# Altium schematic sheet seashell.SchDoc
size Letter
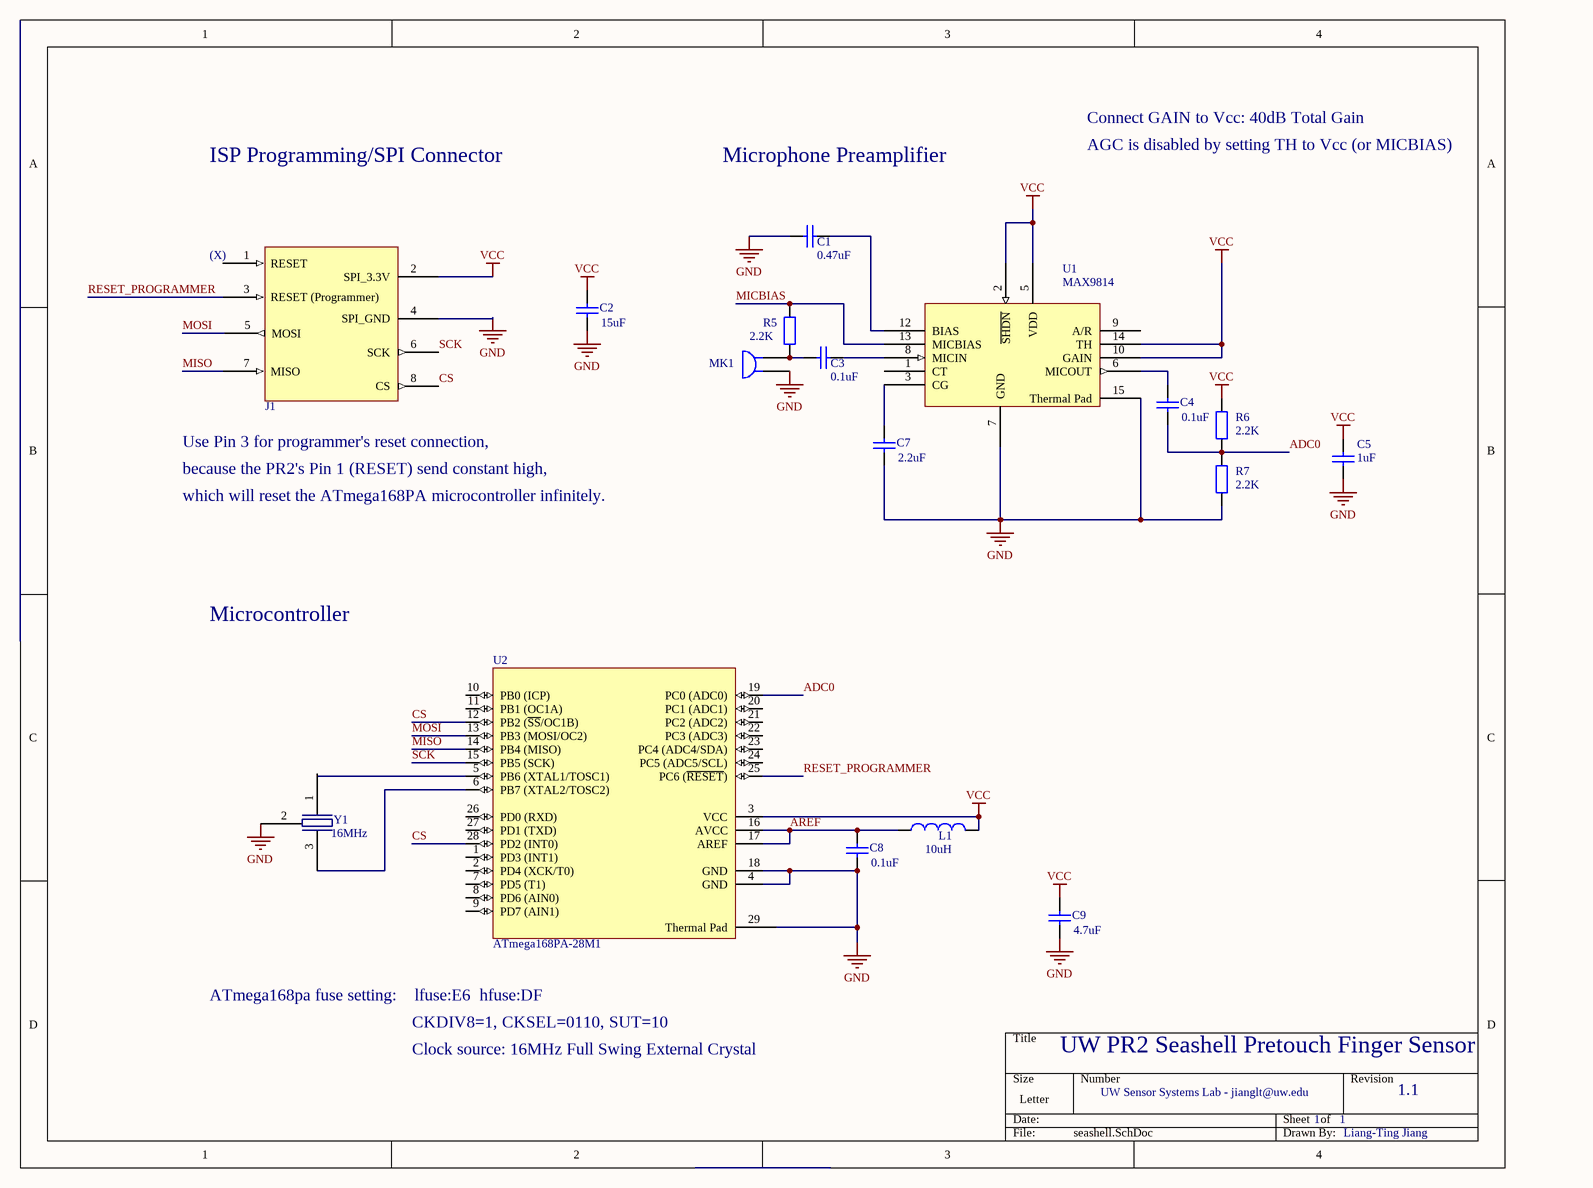
[diagram p0: seashell.SchDoc]

## Parts
C1  0.47uF  [CAPC1608N]
C2  15uF  [CAPC1608N]
C3  0.1uF  [CAPC1608N]
C4  0.1uF  [CAPC1608N]
C5  1uF  [CAPC1608N]
C7  2.2uF  [CAPC1608N]
C8  0.1uF  [CAPC1608N]
C9  4.7uF  [CAPC1608N]
J1  FFC 8-PIN Connector (1mm)  [Hirose FFC connector 8-Pin]  (value not drawn)
L1  10uH  [INDC1608N]
MK1  Panasonic WM-61A  [PIN2]  (value not drawn)
R5  2.2K  [RESC1608N]
R6  2.2K  [RESC1608N]
R7  2.2K  [RESC1608N]
U1  MAX9814  [QFN-14-Minnimum-Solder-Mask-Relief]
U2  ATmega168PA-28M1  [28M1]
Y1  Frequency: 16MHz  [AVX-PRQC Ceramic Resomator SMD]  (hidden comment: AVX PRQC16.00SR5010X000)

## Nets
GND: C1.2 C2.2 C5.1 C7.2 C8.1 C9.2 J1.4(SPI_GND) MK1.1 R7.1 U1.7(GND) U1.15(Thermal_Pad) U2.4(GND) U2.18(GND) U2.29(Thermal_Pad) Y1.2(GND)
VCC: C2.1 C5.2 C9.1 J1.2(SPI_3.3V) L1.2 R6.2 U1.2(~{SHDN}) U1.5(VDD) U1.10(GAIN) U1.14(TH) U2.3(VCC)
ADC0: C4.1 R6.1 R7.2 U2.19(PC0_(ADC0))
AREF: C8.2 L1.1 U2.16(AVCC) U2.17(AREF)
CS: J1.8(CS) U2.12(PB2_(~{SS}/OC1B)) U2.28(PD2_(INT0))
MICBIAS: R5.2 U1.13(MICBIAS)
MISO: J1.7(MISO) U2.14(PB4_(MISO))
MOSI: J1.5(MOSI) U2.13(PB3_(MOSI/OC2))
RESET_PROGRAMMER: J1.3(RESET_(Programmer)) U2.25(PC6_(~{RESET}))
SCK: J1.6(SCK) U2.15(PB5_(SCK))
NetC1_1: C1.1 U1.12(BIAS)
NetC3_1: C3.1 MK1.2 R5.1
NetC3_2: C3.2 U1.8(MICIN)
NetC4_2: C4.2 U1.6(MICOUT)
NetC7_1: C7.1 U1.3(CG)
NetU2_5: U2.5(PB6_(XTAL1/TOSC1)) Y1.1(IN/OUT)
NetU2_6: U2.6(PB7_(XTAL2/TOSC2)) Y1.3(OUT/IN)

Not connected (* = marked no-connect by the designer): J1 1(RESET); U1 1(CT) 4(NC) 9(A/R) 11(NC); U2 1(PD3_(INT1)) 2(PD4_(XCK/T0)) 7(PD5_(T1)) 8(PD6_(AIN0)) 9(PD7_(AIN1)) 10(PB0_(ICP)) 11(PB1_(OC1A)) 20(PC1_(ADC1)) 21(PC2_(ADC2)) 22(PC3_(ADC3)) 23(PC4_(ADC4/SDA)) 24(PC5_(ADC5/SCL)) 26(PD0_(RXD)) 27(PD1_(TXD))

## Notes on the sheet
- ISP Programming/SPI Connector
- Microphone Preamplifier
- Connect GAIN to Vcc: 40dB Total Gain
- AGC is disabled by setting TH to Vcc (or MICBIAS)
- (near J1) (X)
- (near J1) Use Pin 3 for programmer's reset connection,
- because the PR2's Pin 1 (RESET) send constant high,
- which will reset the ATmega168PA microcontroller infinitely.
- Microcontroller
- ATmega168pa fuse setting:    lfuse:E6  hfuse:DF
- CKDIV8=1, CKSEL=0110, SUT=10
- Clock source: 16MHz Full Swing External Crystal
- UW PR2 Seashell Pretouch Finger Sensor
- UW Sensor Systems Lab - jianglt@uw.edu
- 1
- 1.1
- Liang-Ting Jiang

## Library data of the parts
C1-C5 C7-C9 = Cap: 0603 SMD Capacitor; Published: 8-Jun-2000; LatestRevisionDate: 17-Jul-2002; LatestRevisionNote: Re-released for DXP Platform.; PackageReference: RAD-0.3; Publisher: Altium Limited; PackageDescription: Radial Cap, Thru-Hole; 2 Leads; 0.3 in Pin Spacing
  C1: Value: 0.47uF
  C2: Value: 15uF
  C3 C4 C8: Value: 0.1uF
  C5: Value: 1uF
  C7: Value: 2.2uF
  C9: Value: 4.7uF
J1 = FFC Connector-8Pin-SMT-1mm: FFC 8-PIN Connector (1mm) (SMT)
L1 = Inductor: 0603 SMD Inductor; Code_IEC: 1005; Published: 8-Jun-2000; LatestRevisionDate: 29-May-2009; LatestRevisionNote: IPC-7351 Footprint Added.; PackageReference: 0402-A; Publisher: Altium Limited; PackageDescription: Chip Inductor; Code_JEITA: 0402; Value: 10uH
MK1 = Mic1: Electret Microphone; Published: 24-Mar-1999; LatestRevisionDate: 17-Jul-2002; LatestRevisionNote: Re-released for DXP Platform.; PackageReference: PIN2; Publisher: Altium Limited
R5-R7 = Res2: 0603 SMD Resistor; Published: 8-Jun-2000; LatestRevisionDate: 17-Jul-2002; LatestRevisionNote: Re-released for DXP Platform.; PackageReference: AXIAL-0.4; Publisher: Altium Limited; PackageDescription: Axial Device, Thru-Hole; 2 Leads; 0.4 in Pin Spacing; Value: 2.2K
U1 = MAX9814: Microphone Amplifier with AGC and   Low-Noise Microphone Bias
U2 = ATmega168-28M1: 8-Bit AVR Microcontroller with 8K Bytes of In-System Programmable Flash Memory; Published: 17-Sep-2003; LatestRevisionDate: 04-Mar-2005; LatestRevisionNote: Stylized 3D Model Added.; DatasheetVersion: 2486H-AVR-09/02; PackageVersion: revB, Sep-2001; PackageReference: 28P3; Publisher: Altium Limited; PackageDescription: DIP; 28 Leads; Row Spacing 7.62 mm; Pitch 2.54 mm; ComponentLink1Description: Manufacturer Link; ComponentLink1URL: http://www.atmel.com; ComponentLink2Description: Datasheet; ComponentLink2URL: http://www.atmel.com/dyn/resources/prod_documents/doc2486.pdf
Y1 = Ceramic Resonator SMT (w/ cap): 16MHz Ceramic Chip Resonator SMD